# EAGLE design BBB_Cape (EAGLE 6.4)
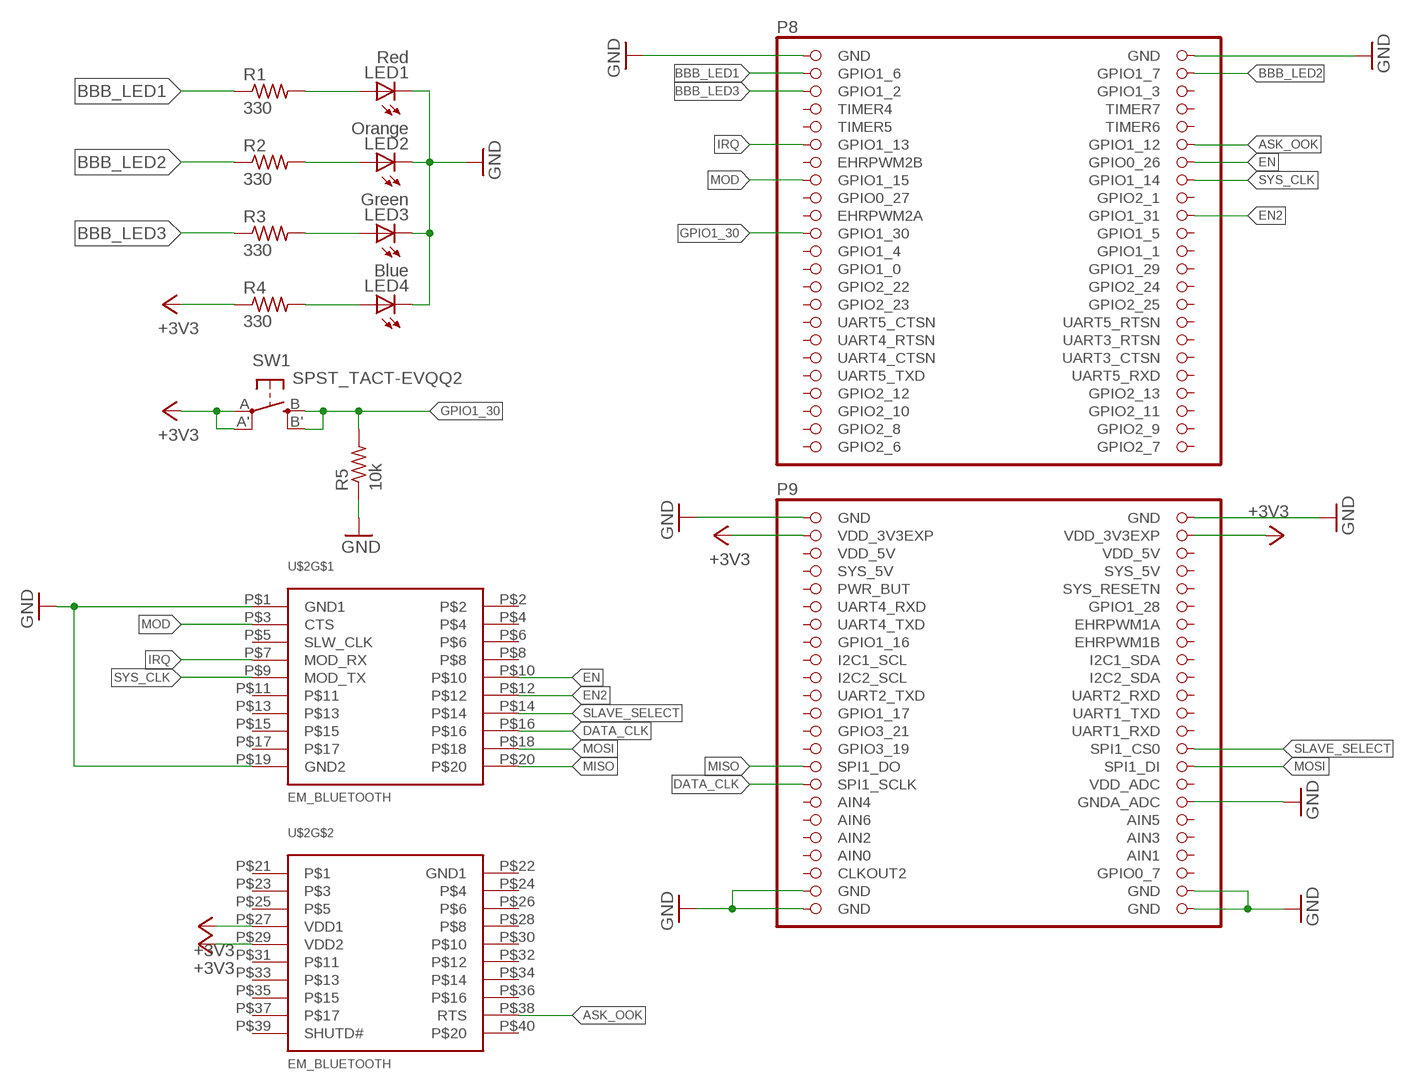
[diagram p0: schematic, sheet 1]

## Parts
LED1  Red  LEDCHIPLED_0805  [CHIPLED_0805]
LED2  Orange  LEDCHIPLED_0805  [CHIPLED_0805]
LED3  Green  LEDCHIPLED_0805  [CHIPLED_0805]
LED4  Blue  LEDCHIPLED_0805  [CHIPLED_0805]
R1  330  R-US_R0805  [R0805]
R2  330  R-US_R0805  [R0805]
R3  330  R-US_R0805  [R0805]
R4  330  R-US_R0805  [R0805]
R5  10k  R-US_R0805  [R0805]
SW1  SPST_TACT-EVQQ2  [EVQ-Q2]
U$1  BEAGLEBONE_OUTLINE  [BEAGLEBONE_SHIELD]
U$2  EM_BLUETOOTH  [EM]

## Nets
+3V3: R4.1 SW1.A'(P1) SW1.A(P) U$1.49(VDD_3V3EXP) U$1.50(VDD_3V3EXP) U$2.P$27(VDD1) U$2.P$29(VDD2)
ASK_OOK: U$1.12(GPIO1_12) U$2.P$38(RTS)
BBB_LED1: R1.1 U$1.3(GPIO1_6)
BBB_LED2: R2.1 U$1.4(GPIO1_7)
BBB_LED3: R3.1 U$1.5(GPIO1_2)
DATA_CLK: U$1.77(SPI1_SCLK) U$2.P$16
EN: U$1.14(GPIO0_26) U$2.P$10
EN2: U$1.20(GPIO1_31) U$2.P$12
GND: LED1.C LED2.C LED3.C LED4.C R5.1 U$1.1(GND) U$1.2(GND) U$1.47(GND) U$1.48(GND) U$1.80(GNDA_ADC) U$1.89(GND) U$1.90(GND) U$1.91(GND) U$1.92(GND) U$2.P$1(GND1) U$2.P$19(GND2)
GPIO1_30: R5.2 SW1.B'(S1) SW1.B(S) U$1.21(GPIO1_30)
IRQ: U$1.11(GPIO1_13) U$2.P$7(MOD_RX)
MISO: U$1.75(SPI1_DO) U$2.P$20
MOD: U$1.15(GPIO1_15) U$2.P$3(CTS)
MOSI: U$1.76(SPI1_DI) U$2.P$18
N$1: LED1.A R1.2
N$2: LED2.A R2.2
N$3: LED3.A R3.2
N$4: LED4.A R4.2
SLAVE_SELECT: U$1.74(SPI1_CS0) U$2.P$14
SYS_CLK: U$1.16(GPIO1_14) U$2.P$9(MOD_TX)
Unconnected: U$1.6(GPIO1_3) U$1.7(TIMER4) U$1.8(TIMER7) U$1.9(TIMER5) U$1.10(TIMER6) U$1.13(EHRPWM2B) U$1.17(GPIO0_27) U$1.18(GPIO2_1) U$1.19(EHRPWM2A) U$1.22(GPIO1_5) U$1.23(GPIO1_4) U$1.24(GPIO1_1) U$1.25(GPIO1_0) U$1.26(GPIO1_29) U$1.27(GPIO2_22) U$1.28(GPIO2_24) U$1.29(GPIO2_23) U$1.30(GPIO2_25) U$1.31(UART5_CTSN) U$1.32(UART5_RTSN) U$1.33(UART4_RTSN) U$1.34(UART3_RTSN) U$1.35(UART4_CTSN) U$1.36(UART3_CTSN) U$1.37(UART5_TXD) U$1.38(UART5_RXD) U$1.39(GPIO2_12) U$1.40(GPIO2_13) U$1.41(GPIO2_10) U$1.42(GPIO2_11) U$1.43(GPIO2_8) U$1.44(GPIO2_9) U$1.45(GPIO2_6) U$1.46(GPIO2_7) U$1.54(SYS_5V) U$1.55(PWR_BUT) U$1.56(SYS_RESETN) U$1.57(UART4_RXD) U$1.58(GPIO1_28) U$1.59(UART4_TXD) U$1.60(EHRPWM1A) U$1.61(GPIO1_16) U$1.62(EHRPWM1B) U$1.63(I2C1_SCL) U$1.64(I2C1_SDA) U$1.65(I2C2_SCL) U$1.66(I2C2_SDA) U$1.67(UART2_TXD) U$1.68(UART2_RXD) U$1.69(GPIO1_17) U$1.70(UART1_TXD) U$1.71(GPIO3_21) U$1.72(UART1_RXD) U$1.73(GPIO3_19) U$1.78(VDD_ADC) U$1.79(AIN4) U$1.81(AIN6) U$1.82(AIN5) U$1.83(AIN2) U$1.84(AIN3) U$1.86(AIN1) U$1.87(CLKOUT2) U$1.88(GPIO0_7) U$2.P$2 U$2.P$4 U$2.P$5(SLW_CLK) U$2.P$6 U$2.P$8 U$2.P$11 U$2.P$13 U$2.P$15 U$2.P$17 U$2.P$21 U$2.P$22(GND1) U$2.P$23 U$2.P$24 U$2.P$25 U$2.P$26 U$2.P$28 U$2.P$30 U$2.P$31 U$2.P$32 U$2.P$33 U$2.P$34 U$2.P$35 U$2.P$36 U$2.P$37 U$2.P$39(SHUTD#) U$2.P$40

## Power pins joined to a net without a drawn wire
AIN0: U$1.85(AIN0)
SYS_5V: U$1.53(SYS_5V)
VDD_5V: U$1.51(VDD_5V) U$1.52(VDD_5V)

## Library data of the parts
LED1 = adafruit:LED: LED OSRAM: - CHIPLED LG R971, LG N971, LY N971, LG Q971, LY Q971, LO R971, LY R971 LH N974, LH R974 LS Q976, LO Q976, LY Q976 LO Q996 - Hyper CHIPLED LW Q18S LB Q993, LB Q99A, LB R99A - SideLED LS A670, LO A670, LY A670, LG A670, LP A670 LB A673, LV A673, LT A673, LW A673 LH A674 LY A675 LS A676, LA A676, LO A676, LY A676, LW A676 LS A679, LY A679, LG A679 - Hyper Micro SIDELED® LS Y876, LA Y876, LO Y876, LY Y876 LT Y87S - SmartLED LW L88C, LW L88S LB L89C, LB L89S, LG L890 LS L89K, LO L89K, LY L89K LS L896, LA L896, LO L896, LY L896 - TOPLED LS T670, LO T670, LY T670, LG T670, LP T670 LSG T670, LSP T670, LSY T670, LOP T670, LYG T670 LG T671, LOG T671, LSG T671 LB T673, LV T673, LT T673, LW T673 LH T674 LS T676, LA T676, LO T676, LY T676, LB T676, LH T676, LSB T676, LW T676 LB T67C, LV T67C, LT T67C, LS T67K, LO T67K, LY T67K, LW E67C LS E67B, LA E67B, LO E67B, LY E67B, LB E67C, LV E67C, LT E67C LW T67C LS T679, LY T679, LG T679 LS T770, LO T770, LY T770, LG T770, LP T770 LB T773, LV T773, LT T773, LW T773 LH T774 LS E675, LA E675, LY E675, LS T675 LS T776, LA T776, LO T776, LY T776, LB T776 LHGB T686 LT T68C, LB T68C - Hyper Mini TOPLED® LB M676 - Mini TOPLED Santana® LG M470 LS M47K, LO M47K, LY M47K Source: http://www.osram.convergy.de/; MPN: KPT-2012SECK-J3; OC_NEWARK: 96W6960
LED2 = adafruit:LED: LED OSRAM: - CHIPLED LG R971, LG N971, LY N971, LG Q971, LY Q971, LO R971, LY R971 LH N974, LH R974 LS Q976, LO Q976, LY Q976 LO Q996 - Hyper CHIPLED LW Q18S LB Q993, LB Q99A, LB R99A - SideLED LS A670, LO A670, LY A670, LG A670, LP A670 LB A673, LV A673, LT A673, LW A673 LH A674 LY A675 LS A676, LA A676, LO A676, LY A676, LW A676 LS A679, LY A679, LG A679 - Hyper Micro SIDELED® LS Y876, LA Y876, LO Y876, LY Y876 LT Y87S - SmartLED LW L88C, LW L88S LB L89C, LB L89S, LG L890 LS L89K, LO L89K, LY L89K LS L896, LA L896, LO L896, LY L896 - TOPLED LS T670, LO T670, LY T670, LG T670, LP T670 LSG T670, LSP T670, LSY T670, LOP T670, LYG T670 LG T671, LOG T671, LSG T671 LB T673, LV T673, LT T673, LW T673 LH T674 LS T676, LA T676, LO T676, LY T676, LB T676, LH T676, LSB T676, LW T676 LB T67C, LV T67C, LT T67C, LS T67K, LO T67K, LY T67K, LW E67C LS E67B, LA E67B, LO E67B, LY E67B, LB E67C, LV E67C, LT E67C LW T67C LS T679, LY T679, LG T679 LS T770, LO T770, LY T770, LG T770, LP T770 LB T773, LV T773, LT T773, LW T773 LH T774 LS E675, LA E675, LY E675, LS T675 LS T776, LA T776, LO T776, LY T776, LB T776 LHGB T686 LT T68C, LB T68C - Hyper Mini TOPLED® LB M676 - Mini TOPLED Santana® LG M470 LS M47K, LO M47K, LY M47K Source: http://www.osram.convergy.de/; MPN: KP-2012SECK; OC_NEWARK: 66W1930
LED3 = adafruit:LED: LED OSRAM: - CHIPLED LG R971, LG N971, LY N971, LG Q971, LY Q971, LO R971, LY R971 LH N974, LH R974 LS Q976, LO Q976, LY Q976 LO Q996 - Hyper CHIPLED LW Q18S LB Q993, LB Q99A, LB R99A - SideLED LS A670, LO A670, LY A670, LG A670, LP A670 LB A673, LV A673, LT A673, LW A673 LH A674 LY A675 LS A676, LA A676, LO A676, LY A676, LW A676 LS A679, LY A679, LG A679 - Hyper Micro SIDELED® LS Y876, LA Y876, LO Y876, LY Y876 LT Y87S - SmartLED LW L88C, LW L88S LB L89C, LB L89S, LG L890 LS L89K, LO L89K, LY L89K LS L896, LA L896, LO L896, LY L896 - TOPLED LS T670, LO T670, LY T670, LG T670, LP T670 LSG T670, LSP T670, LSY T670, LOP T670, LYG T670 LG T671, LOG T671, LSG T671 LB T673, LV T673, LT T673, LW T673 LH T674 LS T676, LA T676, LO T676, LY T676, LB T676, LH T676, LSB T676, LW T676 LB T67C, LV T67C, LT T67C, LS T67K, LO T67K, LY T67K, LW E67C LS E67B, LA E67B, LO E67B, LY E67B, LB E67C, LV E67C, LT E67C LW T67C LS T679, LY T679, LG T679 LS T770, LO T770, LY T770, LG T770, LP T770 LB T773, LV T773, LT T773, LW T773 LH T774 LS E675, LA E675, LY E675, LS T675 LS T776, LA T776, LO T776, LY T776, LB T776 LHGB T686 LT T68C, LB T68C - Hyper Mini TOPLED® LB M676 - Mini TOPLED Santana® LG M470 LS M47K, LO M47K, LY M47K Source: http://www.osram.convergy.de/; MPN: KP-2012CGCK; OC_NEWARK: 66W1927
LED4 = adafruit:LED: LED OSRAM: - CHIPLED LG R971, LG N971, LY N971, LG Q971, LY Q971, LO R971, LY R971 LH N974, LH R974 LS Q976, LO Q976, LY Q976 LO Q996 - Hyper CHIPLED LW Q18S LB Q993, LB Q99A, LB R99A - SideLED LS A670, LO A670, LY A670, LG A670, LP A670 LB A673, LV A673, LT A673, LW A673 LH A674 LY A675 LS A676, LA A676, LO A676, LY A676, LW A676 LS A679, LY A679, LG A679 - Hyper Micro SIDELED® LS Y876, LA Y876, LO Y876, LY Y876 LT Y87S - SmartLED LW L88C, LW L88S LB L89C, LB L89S, LG L890 LS L89K, LO L89K, LY L89K LS L896, LA L896, LO L896, LY L896 - TOPLED LS T670, LO T670, LY T670, LG T670, LP T670 LSG T670, LSP T670, LSY T670, LOP T670, LYG T670 LG T671, LOG T671, LSG T671 LB T673, LV T673, LT T673, LW T673 LH T674 LS T676, LA T676, LO T676, LY T676, LB T676, LH T676, LSB T676, LW T676 LB T67C, LV T67C, LT T67C, LS T67K, LO T67K, LY T67K, LW E67C LS E67B, LA E67B, LO E67B, LY E67B, LB E67C, LV E67C, LT E67C LW T67C LS T679, LY T679, LG T679 LS T770, LO T770, LY T770, LG T770, LP T770 LB T773, LV T773, LT T773, LW T773 LH T774 LS E675, LA E675, LY E675, LS T675 LS T776, LA T776, LO T776, LY T776, LB T776 LHGB T686 LT T68C, LB T68C - Hyper Mini TOPLED® LB M676 - Mini TOPLED Santana® LG M470 LS M47K, LO M47K, LY M47K Source: http://www.osram.convergy.de/; MPN: KPHBM-2012PBASURKC; OC_NEWARK: 49P5362
R1-R4 = adafruit:R-US_: RESISTOR, American symbol; MF: BOURNS, INC.; MPN: CR0603-JW-331ELF; OC_NEWARK: 02J2330
R5 = adafruit:R-US_: RESISTOR, American symbol; MF: VISHAY/DALE; MPN: CRCW080510K0FKTA; OC_NEWARK: 05F1511
SW1 = adafruit:SPST_TACT: SMT 6mm switch, EVQQ2 series http://www.ladyada.net/library/eagle; OC_NEWARK: unknown
U$1 = adafruit:BEAGLEBONE_OUTLINE: Should match A3 pinout - but not completely tested; OC_NEWARK: unknown
U$2 = quad:EM_BLUETOOTH; OC_NEWARK: unknown

## Board
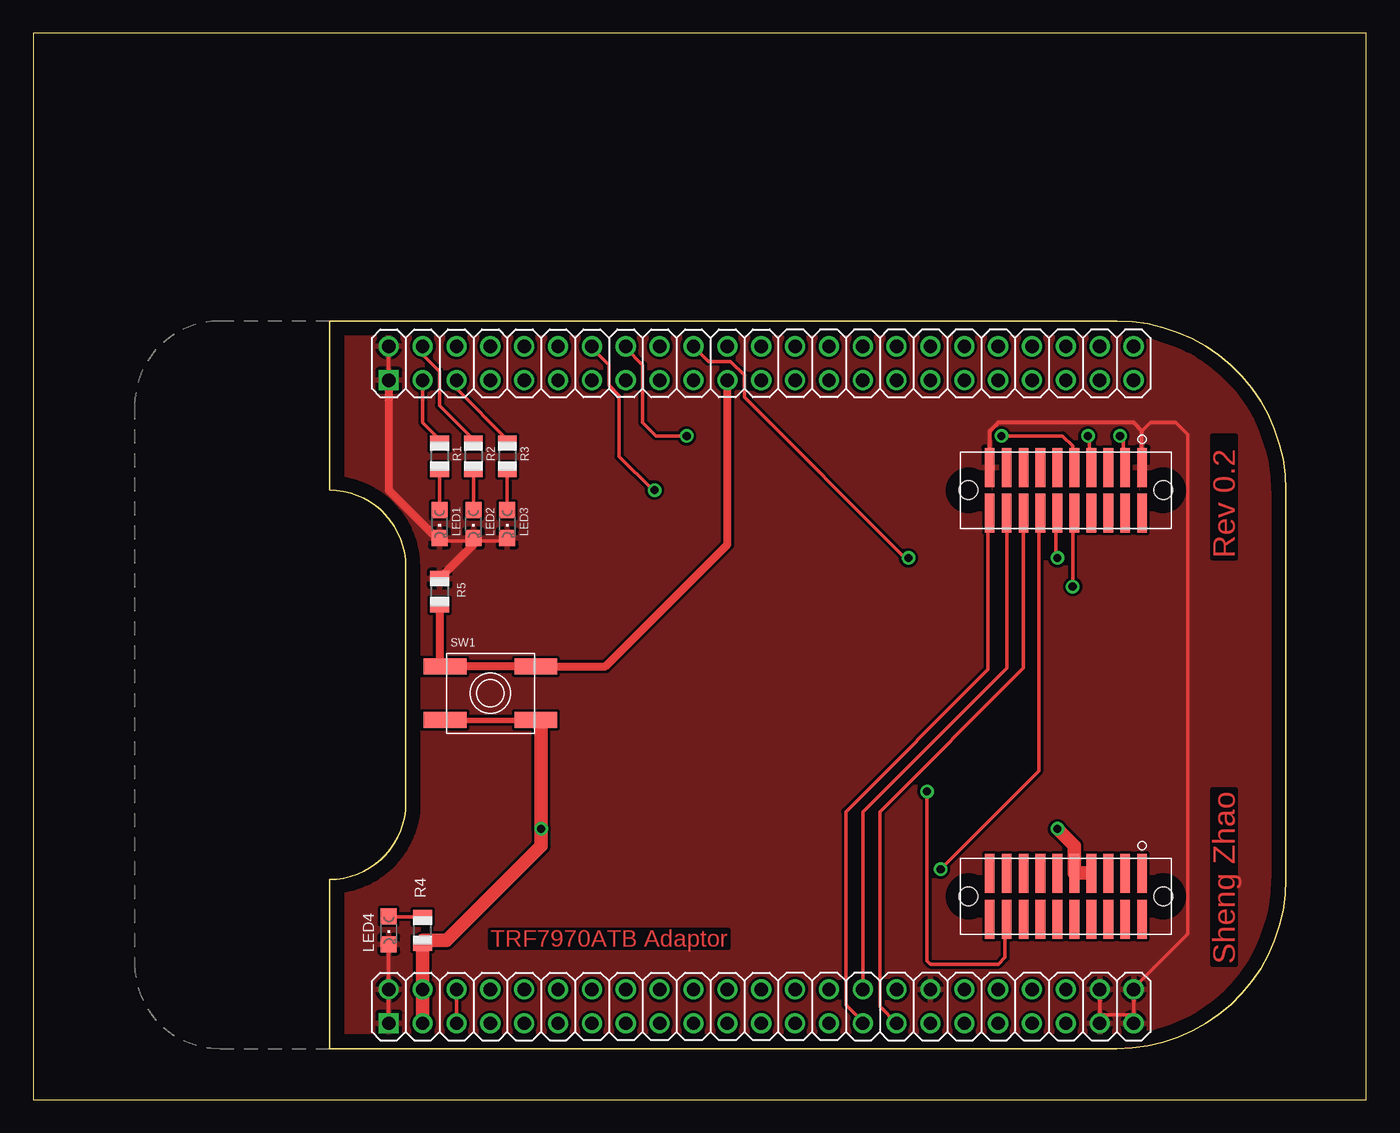
[diagram p1: board, top side]
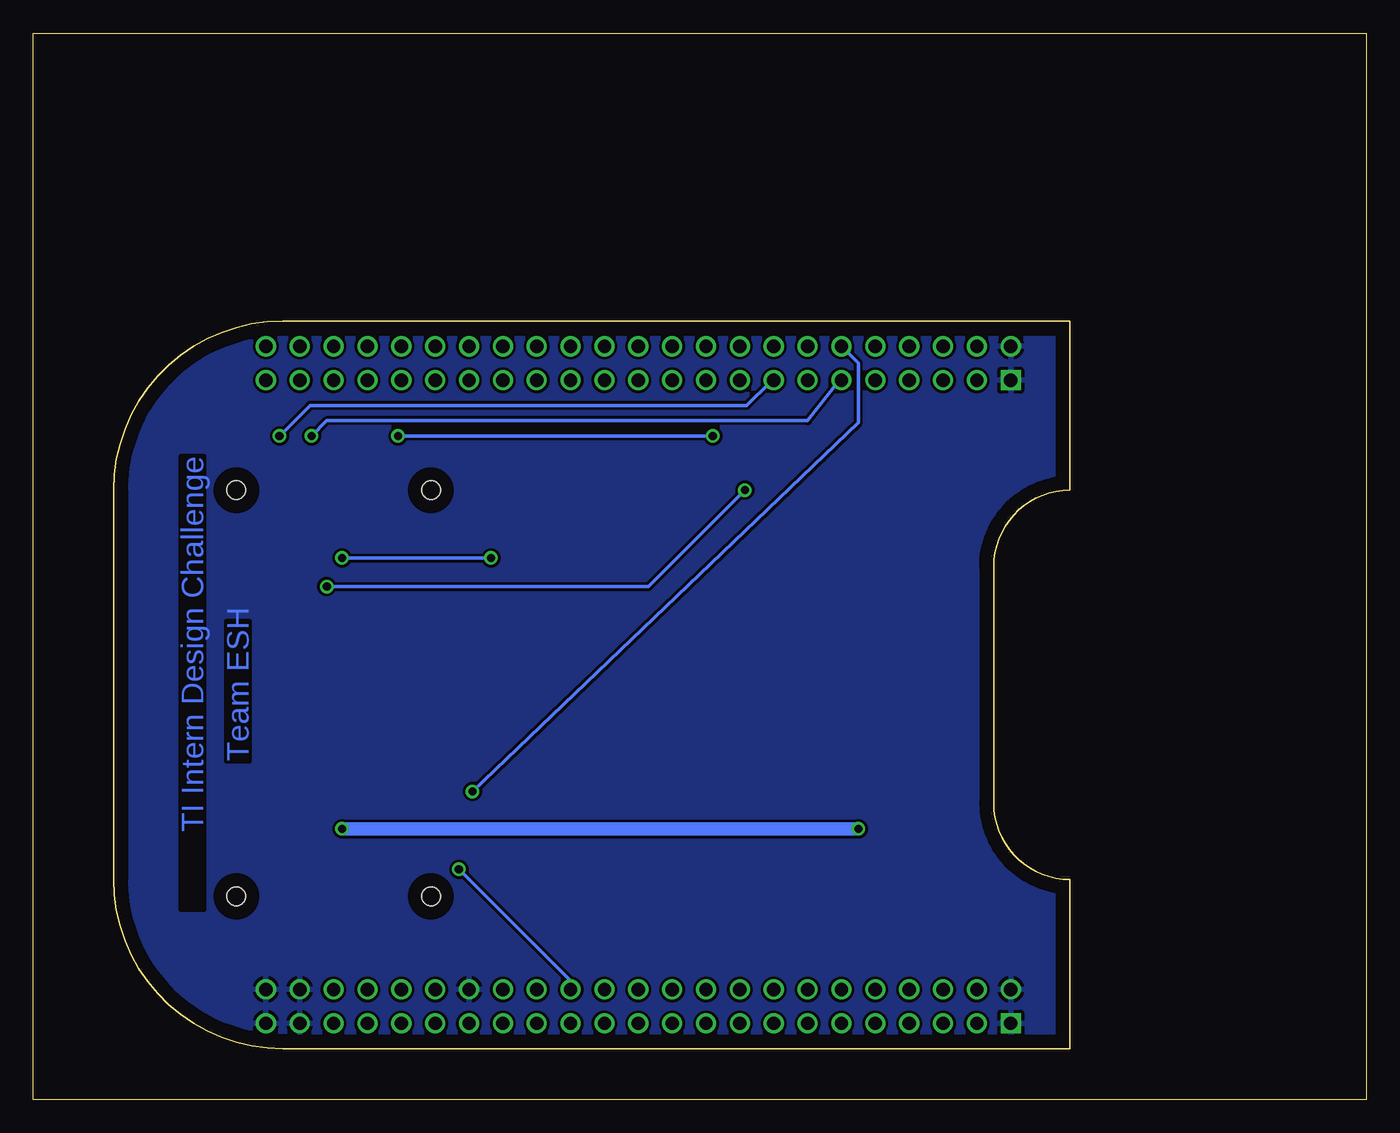
[diagram p2: board, bottom side, seen from below]

Size 100 x 80 mm. Coordinates in mm from the lower left corner, seen from the top.
Outline: 0,0 100,0 100,80 0,80 0,0
Copper layers (1*16): Top 0.035mm / dielectric 1.5mm / Bottom 0.035mm
Design rules "default": minimum track width 10mil, minimum drill 24mil, track to track 8mil, track to pad 8mil, pad to pad 8mil, via to via 8mil, smd to smd 8mil, copper to edge 40mil, drill to drill 8mil, minimum pad ring 10mil, minimum via ring 8mil, stop-mask expansion 4mil, vias tented up to drill 0mil, thermal gap 10mil

### Footprints (pad centres in the part's own frame; a part is rotated, then mirrored left to right if it is on the bottom)
CHIPLED_0805 = smd 1.2 x 1.2: A 0,-1.05; C 0,1.05
R0805 = smd 1.1 x 1.4: 1 -1,0; 2 1,0
EVQ-Q2 = smd 3.2 x 1.2: A -3.4,-2; A' 3.4,-2; B -3.4,2; B' 3.4,2
BEAGLEBONE_SHIELD = drill 1 square: 1 4.445,19.05; 47 52.705,19.05 | drill 1: 2 1.905,19.05; 3 4.445,21.59; 4 1.905,21.59; 5 4.445,24.13; 6 1.905,24.13; 7 4.445,26.67; 8 1.905,26.67; 9 4.445,29.21; 10 1.905,29.21; 11 4.445,31.75; 12 1.905,31.75; 13 4.445,34.29; 14 1.905,34.29; 15 4.445,36.83; 16 1.905,36.83; 17 4.445,39.37; 18 1.905,39.37; 19 4.445,41.91; 20 1.905,41.91; 21 4.445,44.45; 22 1.905,44.45; 23 4.445,46.99; 24 1.905,46.99; 25 4.445,49.53; 26 1.905,49.53; 27 4.445,52.07; 28 1.905,52.07; 29 4.445,54.61; 30 1.905,54.61; 31 4.445,57.15; 32 1.905,57.15; 33 4.445,59.69; 34 1.905,59.69; 35 4.445,62.23; 36 1.905,62.23; 37 4.445,64.77; 38 1.905,64.77; 39 4.445,67.31; 40 1.905,67.31; 41 4.445,69.85; 42 1.905,69.85; 43 4.445,72.39; 44 1.905,72.39; 45 4.445,74.93; 46 1.905,74.93; 48 50.165,19.05; 49 52.705,21.59; 50 50.165,21.59; 51 52.705,24.13; 52 50.165,24.13; 53 52.705,26.67; 54 50.165,26.67; 55 52.705,29.21; 56 50.165,29.21; 57 52.705,31.75; 58 50.165,31.75; 59 52.705,34.29; 60 50.165,34.29; 61 52.705,36.83; 62 50.165,36.83; 63 52.705,39.37; 64 50.165,39.37; 65 52.705,41.91; 66 50.165,41.91; 67 52.705,44.45; 68 50.165,44.45; 69 52.705,46.99; 70 50.165,46.99; 71 52.705,49.53; 72 50.165,49.53; 73 52.705,52.07; 74 50.165,52.07; 75 52.705,54.61; 76 50.165,54.61; 77 52.705,57.15; 78 50.165,57.15; 79 52.705,59.69; 80 50.165,59.69; 81 52.705,62.23; 82 50.165,62.23; 83 52.705,64.77; 84 50.165,64.77; 85 52.705,67.31; 86 50.165,67.31; 87 52.705,69.85; 88 50.165,69.85; 89 52.705,72.39; 90 50.165,72.39; 91 52.705,74.93; 92 50.165,74.93
EM = smd 0.737 x 2.921: P$1 -5.715,-1.714; P$2 -5.715,1.714; P$3 -4.445,-1.714; P$4 -4.445,1.714; P$5 -3.175,-1.714; P$6 -3.175,1.714; P$7 -1.905,-1.714; P$8 -1.905,1.714; P$9 -0.635,-1.714; P$10 -0.635,1.714; P$11 0.635,-1.714; P$12 0.635,1.714; P$13 1.905,-1.714; P$14 1.905,1.714; P$15 3.175,-1.714; P$16 3.175,1.714; P$17 4.445,-1.714; P$18 4.445,1.714; P$19 5.715,-1.714; P$20 5.715,1.714; P$21 -5.715,28.765; P$22 -5.715,32.194; P$23 -4.445,28.765; P$24 -4.445,32.194; P$25 -3.175,28.765; P$26 -3.175,32.194; P$27 -1.905,28.765; P$28 -1.905,32.194; P$29 -0.635,28.765; P$30 -0.635,32.194; P$31 0.635,28.765; P$32 0.635,32.194; P$33 1.905,28.765; P$34 1.905,32.194; P$35 3.175,28.765; P$36 3.175,32.194; P$37 4.445,28.765; P$38 4.445,32.194; P$39 5.715,28.765; P$40 5.715,32.194 | hole 1.397: -7.303,0; 7.303,0; -7.303,30.48; 7.303,30.48

### Placement (x,y rotation side)
LED1  30.48,43.18 180 top
LED2  33.02,43.18 180 top
LED3  35.56,43.18 180 top
LED4  26.67,12.7 180 top
R1  30.48,48.26 270 top
R2  33.02,48.26 270 top
R3  35.56,48.26 270 top
R4  29.21,12.7 90 top
R5  30.48,38.1 270 top
SW1  34.29,30.48 0 top
U$1  7.62,58.42 270 top
U$2  77.47,45.72 180 top

### Tracks (layer width: path | path; a pad name or v marks a point on that pad's centre or on a via)
+3V3  (via drill 0.61)
  Top 0.254: 78.23,17.02 U$2.P$29 | 79.25,17.02 U$2.P$27 | 30.99,28.45 SW1.A 30.73,28.45 30.48,28.19 | 37.59,28.45 SW1.A' | 29.21,11.94 R4.1
  Top 0.406: 37.59,28.45 30.99,28.45
  Top 1.016: R4.1 U$1.50 U$1.49 | 79.25,17.02 78.23,17.02 | 29.21,11.94 30.99,11.94 38.1,19.05 v38.1,20.32 38.1,28.07 SW1.A' | U$2.P$29 78.11,19.05 v76.83,20.32
  Bottom 1.016: v76.83,20.32 v38.1,20.32
ASK_OOK  (via drill 0.61)
  Top 0.254: U$2.P$38 72.9,13.46 72.9,10.67 72.39,10.16 67.31,10.16 67.06,10.41 v67.06,23.11 | 39.37,56.39 U$1.12
  Bottom 0.254: v67.06,23.11 38.1,50.8 38.1,55.24 U$1.12
BBB_LED1
  Top 0.254: U$1.3 29.21,50.8 30.48,49.53 R1.1
BBB_LED2
  Top 0.254: R2.1 33.02,49.53 30.48,52.07 30.48,54.61 29.21,55.88 U$1.4
BBB_LED3
  Top 0.254: R3.1 35.56,49.53 31.75,53.34 U$1.5
DATA_CLK
  Top 0.254: U$2.P$16 74.3,32.38 63.5,21.59 63.5,6.99 U$1.77
EN  (via drill 0.61)
  Top 0.254: v77.98,38.48 77.98,43.94 U$2.P$10 | U$1.14 41.91,56.39 43.18,55.12 43.18,53.59 43.94,52.83 43.94,48.26 46.48,45.72 v46.61,45.72
  Bottom 0.254: v77.98,38.48 53.85,38.48 v46.61,45.72
EN2  (via drill 0.61)
  Top 0.254: U$2.P$12 76.71,43.94 76.71,40.77 v76.83,40.64 | v65.66,40.64 65.41,40.64 53.34,52.7 53.34,54.36 52.32,55.37 50.67,55.37 U$1.20
  Bottom 0.254: v76.83,40.64 v65.66,40.64
GND
  Top 0.254: 33.02,41.91 30.48,41.91 LED1.C | 33.02,41.91 35.56,41.91 LED3.C | 33.02,41.91 LED2.C | U$1.1 U$1.2 | LED4.C U$1.48 U$1.47 | 82.55,6.35 U$1.92 82.55,8.38 86.61,12.45 86.61,49.91 85.72,50.8 83.82,50.8 83.19,50.16 | U$1.90 80.01,6.35 | 80.01,6.35 82.55,6.35 | 82.55,6.35 U$1.91 | 80.01,6.35 U$1.89 | 71.63,47.5 U$2.P$19 | 83.31,47.5 U$2.P$1 | 33.02,41.91 33.02,41.64
  Top 0.305: U$2.P$1 83.19,50.16 82.55,50.8 72.39,50.8 71.75,50.16 U$2.P$19
  Top 0.61: 30.48,41.91 26.67,45.72 U$1.1 | 33.02,41.64 R5.1
  Bottom 0.254: 67.31,8.89 U$1.80 | 80.01,8.89 U$1.90 | 26.67,8.89 U$1.48
  pour Top: 21.59,58.42 21.59,3.81 93.98,3.81 93.98,58.42
  pour Bottom: 22.86,58.42 21.59,58.42 21.59,3.81 93.98,3.81 93.98,5.08 93.98,58.42
GPIO1_30
  Top 0.254: 30.99,32.51 SW1.B 30.48,32.89 | 37.59,32.51 SW1.B' 37.85,32.51
  Top 0.61: 37.59,32.51 30.99,32.51 | U$1.21 52.07,41.66 42.93,32.51 37.85,32.51 | R5.2 30.48,32.89
IRQ  (via drill 0.61)
  Top 0.254: U$2.P$7 79.25,47.5 79.25,49.66 v79.12,49.78
  Bottom 0.254: U$1.11 39.37,53.85 39.62,53.85 41.91,50.93 77.98,50.93 v79.12,49.78
MISO
  Top 0.254: U$2.P$20 71.63,43.94 71.63,32.26 60.96,21.59 60.96,7.11 62.23,5.84 U$1.75
MOD  (via drill 0.61)
  Top 0.254: U$2.P$3 81.79,47.5 81.79,49.53 v81.53,49.78
  Bottom 0.254: v81.53,49.78 79.25,52.07 46.48,52.07 44.7,53.85 44.45,53.85 U$1.15
MOSI
  Top 0.254: U$2.P$18 73.03,32.38 62.23,21.59 U$1.76
N$1
  Top 0.254: R1.2 LED1.A
N$2
  Top 0.254: R2.2 LED2.A
N$3
  Top 0.254: R3.2 LED3.A
N$4
  Top 0.254: LED4.A 26.67,13.72 29.21,13.72 R4.2
SLAVE_SELECT  (via drill 0.61)
  Top 0.254: v68.07,17.27 75.44,24.64 75.44,43.94 U$2.P$14
  Bottom 0.254: v68.07,17.27 59.69,8.89 U$1.74
SYS_CLK  (via drill 0.61)
  Top 0.254: U$2.P$9 77.98,47.5 77.98,49.02 77.22,49.78 v72.64,49.78 | U$1.16 44.45,56.39 45.72,55.12 45.72,50.8 46.74,49.78 v49.02,49.78
  Bottom 0.254: v49.02,49.78 v72.64,49.78
VDD_5V
  Top 0.254: U$1.52 U$1.51

### Text on the board
Top: Rev 0.2 | TRF7970ATB Adaptor | Sheng Zhao
Bottom: TI Intern Design Challenge | Team ESH